# EAGLE design Schematic (EAGLE 9.3.0)

## Sheet 1 of 3: In/Out
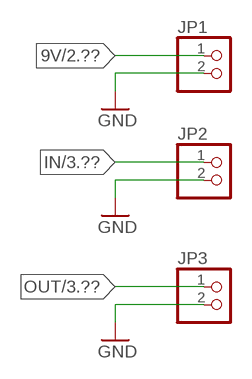
[diagram p0: schematic, sheet 1]

### Parts
JP1  PINHD-1X2  [1X02]
JP2  PINHD-1X2  [1X02]
JP3  PINHD-1X2  [1X02]

### Nets
9V: JP1.1 ; also sheet 2,3
GND: JP1.2 JP2.2 JP3.2 ; also sheet 2,3
IN: JP2.1 ; also sheet 3
OUT: JP3.1 ; also sheet 3

## Sheet 2 of 3: Supply
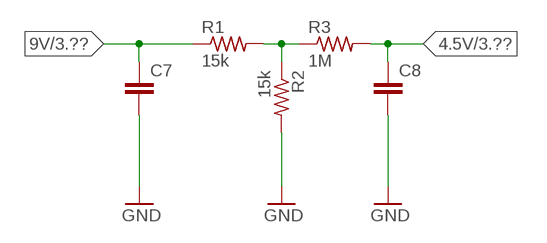
[diagram p1: schematic, sheet 2]

### Parts
C7  C-EU025-025X050  [C025-025X050]
C8  C-EU025-025X050  [C025-025X050]
R1  15k  R-US_0204/7  [0204/7]
R2  15k  R-US_0204/7  [0204/7]
R3  1M  R-US_0204/7  [0204/7]

### Nets
4.5V: C8.1 R3.2 ; also sheet 3
9V: C7.1 R1.1 ; also sheet 1,3
GND: C7.2 C8.2 R2.2 ; also sheet 1,3
N$2: R1.2 R2.1 R3.1

## Sheet 3 of 3: Effect
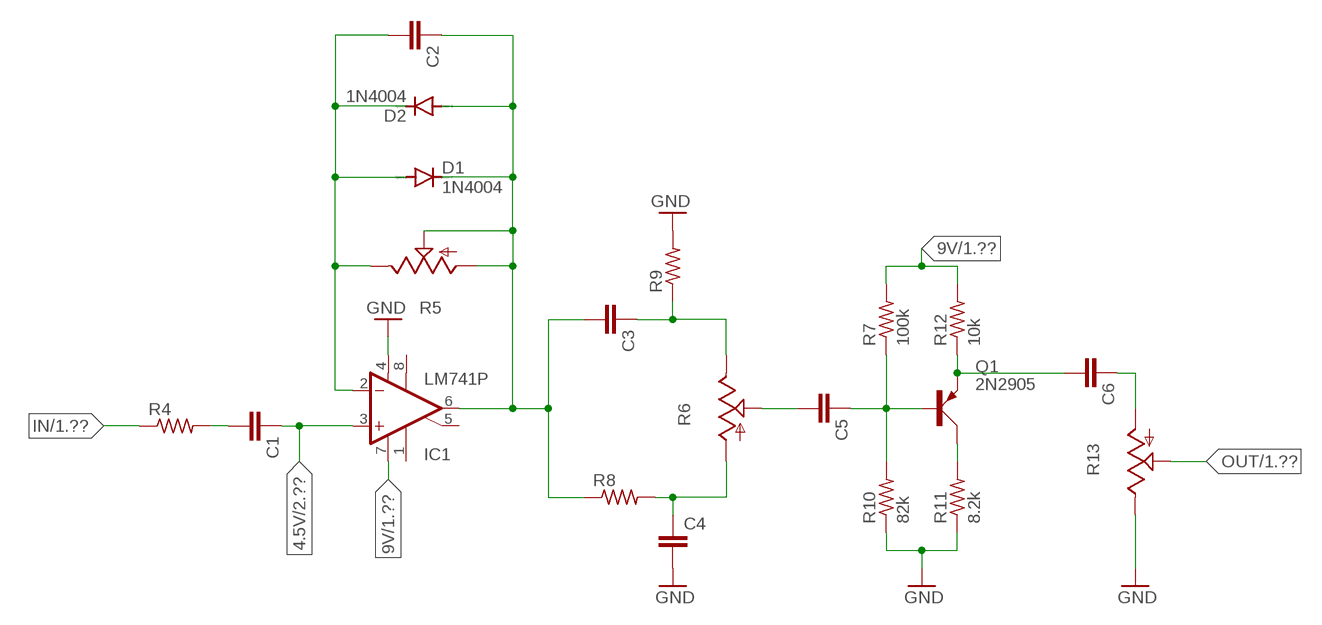
[diagram p2: schematic, sheet 3]

### Parts
C1  C-EU025-025X050  [C025-025X050]
C2  C-EU025-025X050  [C025-025X050]
C3  C-EU025-025X050  [C025-025X050]
C4  C-EU025-025X050  [C025-025X050]
C5  C-EU025-025X050  [C025-025X050]
C6  C-EU025-025X050  [C025-025X050]
D1  1N4004  [DO41-10]
D2  1N4004  [DO41-10]
IC1  LM741P  [DIL08]
Q1  2N2905  [TO39]
R4  R-US_0204/7  [0204/7]
R5  TRIM_US-B64Y  [B64Y]
R6  TRIM_US-B64Y  [B64Y]
R7  100k  R-US_0204/7  [0204/7]
R8  R-US_0204/7  [0204/7]
R9  R-US_0204/7  [0204/7]
R10  82k  R-US_0204/7  [0204/7]
R11  8.2k  R-US_0204/7  [0204/7]
R12  10k  R-US_0204/7  [0204/7]
R13  TRIM_US-B64Y  [B64Y]

### Nets
4.5V: C1.1 IC1.3(+IN) ; also sheet 2
9V: IC1.7(V+) R7.2 R12.2 ; also sheet 1,2
GND: C4.2 IC1.4(V-) R9.2 R10.1 R11.1 R13.E ; also sheet 1,2
IN: R4.1 ; also sheet 1
N$1: C1.2 R4.2
N$3: C2.1 C3.2 D1.C D2.A IC1.6(OUT) R5.A R5.S R8.1
N$4: C2.2 D1.A D2.C IC1.2(-IN) R5.E
N$5: C3.1 R6.E R9.1
N$6: C4.1 R6.A R8.2
N$7: C5.2 R6.S
N$8: C5.1 Q1.2(B) R7.1 R10.2
N$9: C6.2 Q1.1(E) R12.1
N$10: Q1.3(C) R11.2
N$11: C6.1 R13.A
OUT: R13.S ; also sheet 1
Unconnected: IC1.1(ON1) IC1.5(ON2) IC1.8(OPT)

## Library data of the parts
C1-C8 = rcl:C-EU: CAPACITOR, European symbol; SPICEPREFIX: C
D1 D2 = diode:1N4004: DIODE general purpose rectifier, 1 A
IC1 = linear:*741: OP AMP
JP1-JP3 = pinhead:PINHD-1X2: PIN HEADER
Q1 = transistor-small-signal:2N2905: PNP bipolar
R1-R4 R7-R12 = rcl:R-US_: RESISTOR, American symbol; SPICEPREFIX: R
R5 R6 R13 = pot:TRIM_US-: POTENTIOMETER

## Board
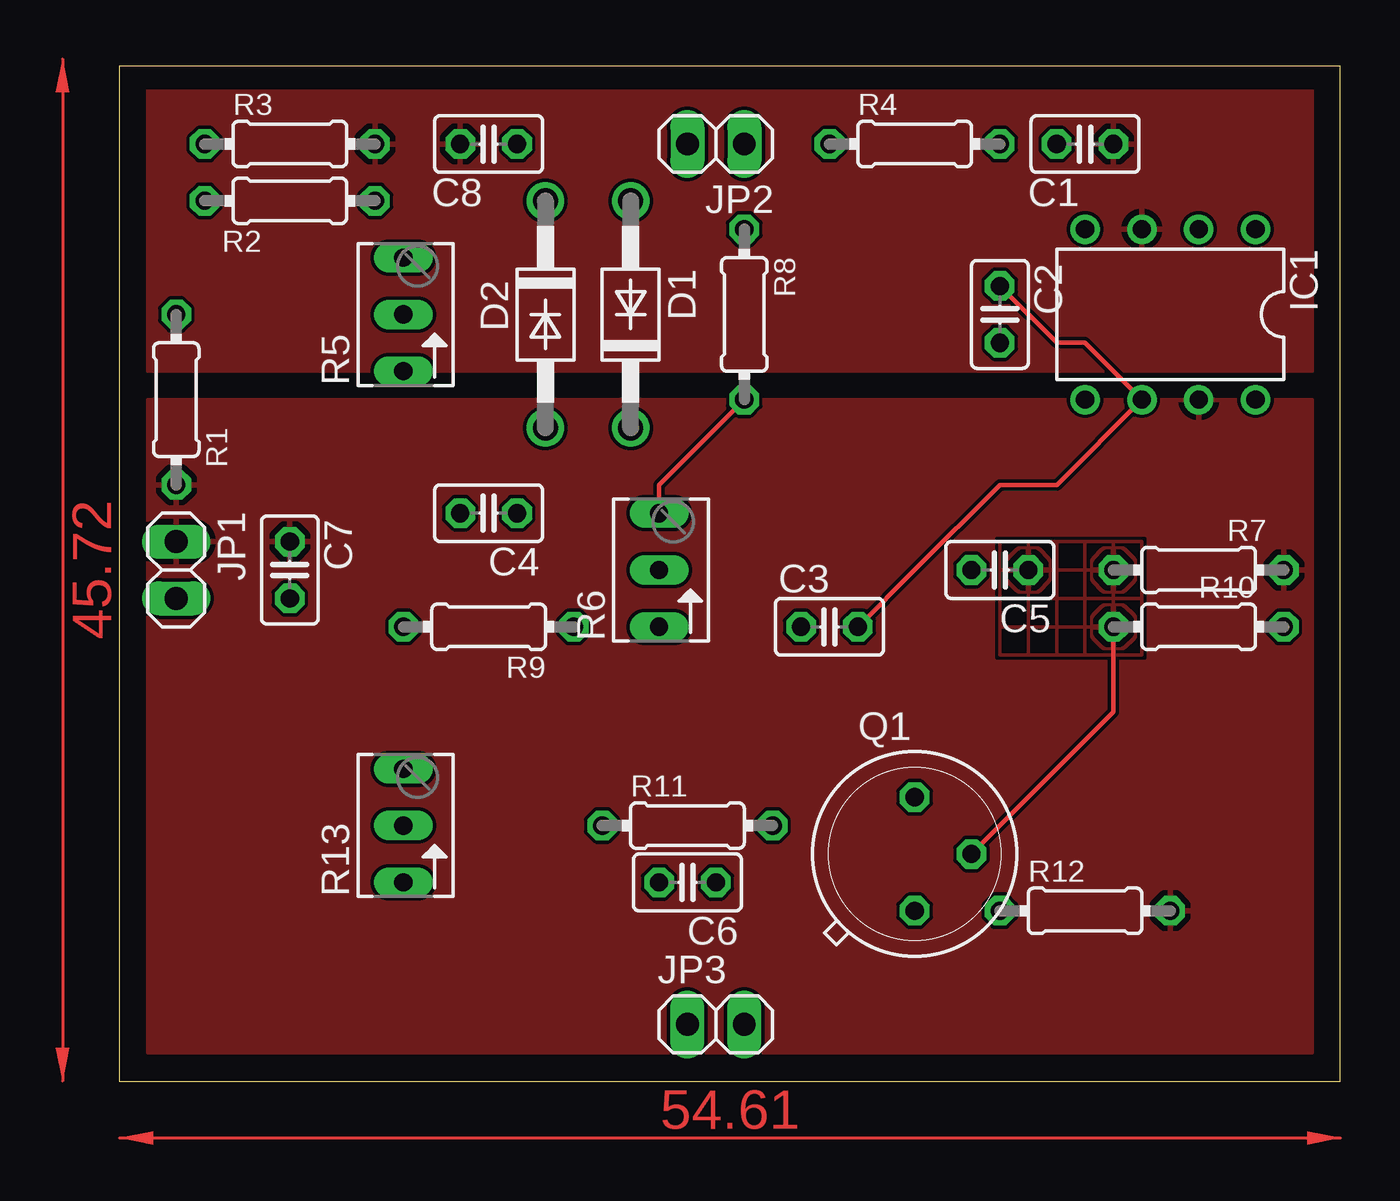
[diagram p3: board, top side]
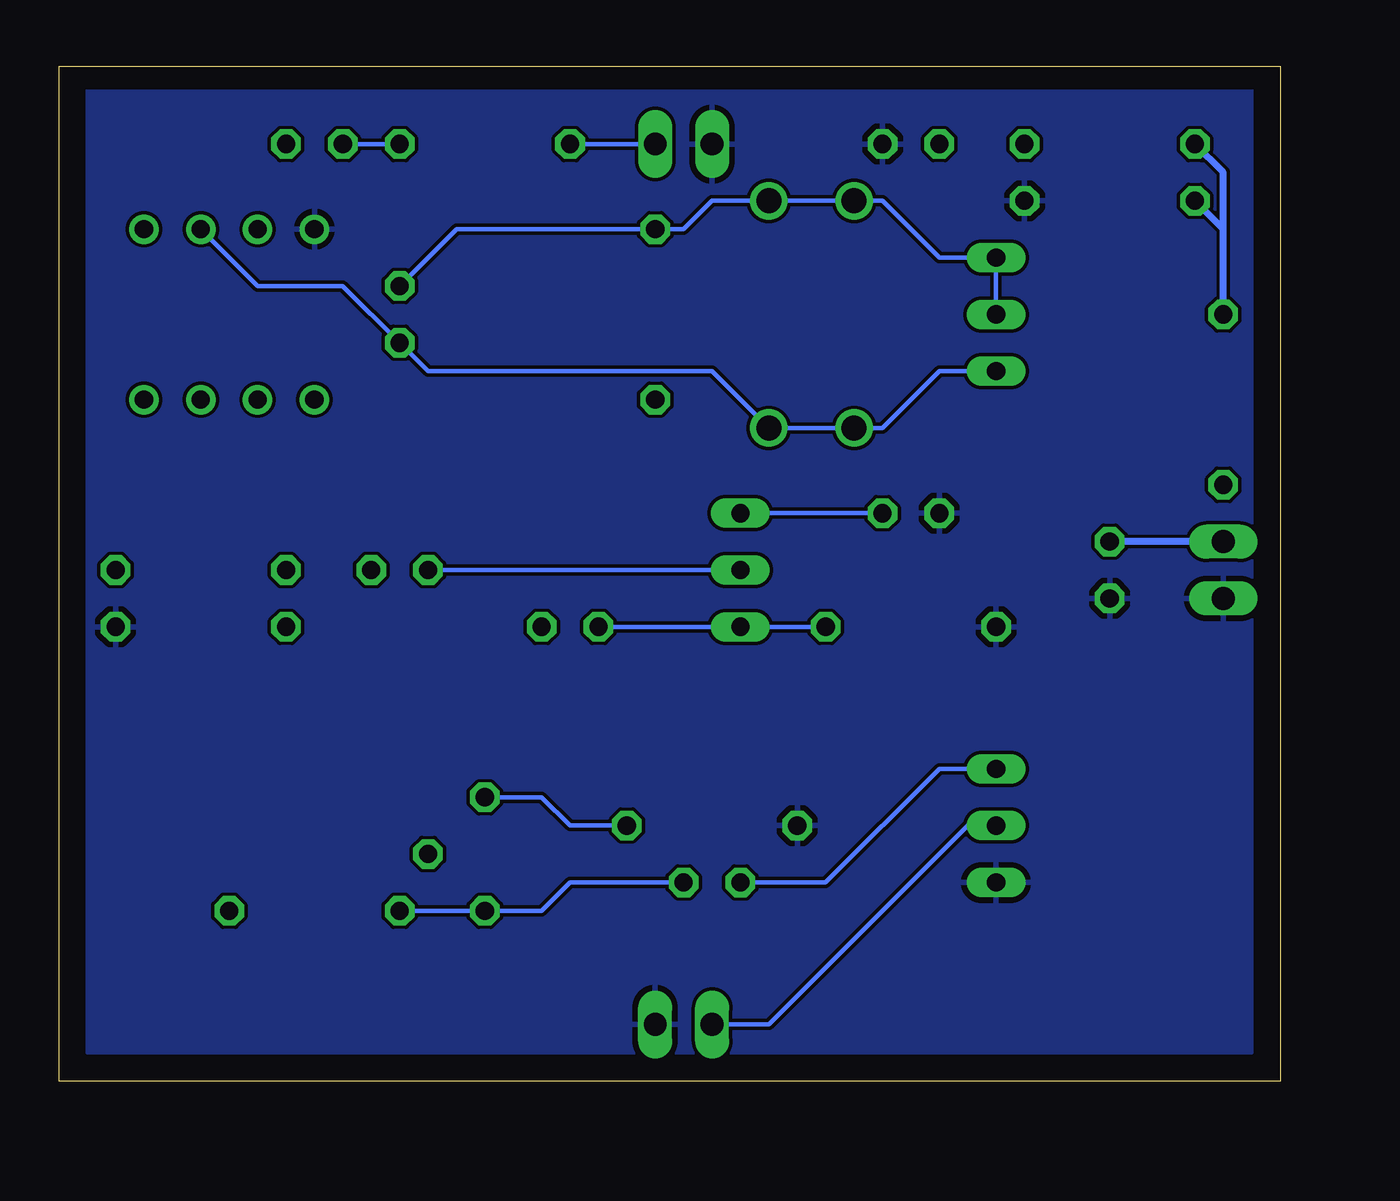
[diagram p4: board, bottom side, seen from below]

Size 54.59 x 45.39 mm. Coordinates in mm from the lower left corner, seen from the top.
Outline: 0,0 54.59,0 54.59,45.39 0,45.39 0,0
Copper layers (1*16): Top 0.035mm / dielectric 1.5mm / Bottom 0.035mm
Design rules "default": minimum track width 6mil, minimum drill 0.35mm, track to track 6mil, track to pad 6mil, pad to pad 6mil, via to via 6mil, smd to smd 6mil, copper to edge 40mil, drill to drill 6mil, minimum pad ring 10mil, minimum via ring 8mil, stop-mask expansion 4mil, vias tented up to drill 0mil, thermal gap 10mil

### Footprints (pad centres in the part's own frame; a part is rotated, then mirrored left to right if it is on the bottom)
C025-025X050 = drill 0.813 octagon: 1 -1.27,0; 2 1.27,0
DO41-10 = drill 1.118: A 5.08,0; C -5.08,0
DIL08 = drill 0.813 pad 1.27: 1 -3.81,-3.81; 2 -1.27,-3.81; 3 1.27,-3.81; 4 3.81,-3.81; 5 3.81,3.81; 6 1.27,3.81; 7 -1.27,3.81; 8 -3.81,3.81
1X02 = drill 1.016 long: 1 -1.27,0; 2 1.27,0
TO39 = drill 0.813 octagon: 1 0,-2.54; 2 2.54,0; 3 0,2.54
0204/7 = drill 0.813 octagon: 1 -3.81,0; 2 3.81,0
B64Y = drill 0.813 long: A 2.54,0; E -2.54,0; S 0,0

### Placement (x,y rotation side)
C1  43.18,41.91 180 top
C2  39.37,34.29 270 top
C3  31.75,20.32 0 top
C4  16.51,25.4 180 top
C5  39.37,22.86 180 top
C6  25.4,8.89 0 top
C7  7.62,22.86 270 top
C8  16.51,41.91 0 top
D1  19.05,34.29 270 top
D2  22.86,34.29 90 top
IC1  46.99,34.29 180 top
JP1  2.54,22.86 270 top
JP2  26.67,41.91 180 top
JP3  26.67,2.54 0 top
Q1  35.56,10.16 0 top
R1  2.54,30.48 90 top
R2  7.62,39.37 0 top
R3  7.62,41.91 0 top
R4  35.56,41.91 0 top
R5  12.7,34.29 90 top
R6  24.13,22.86 90 top
R7  48.26,22.86 0 top
R8  27.94,34.29 270 top
R9  16.51,20.32 180 top
R10  48.26,20.32 180 top
R11  25.4,11.43 0 top
R12  43.18,7.62 0 top
R13  12.7,11.43 90 top

### Tracks (layer width: path | path; a pad name or v marks a point on that pad's centre or on a via)
4.5V
  pour Top: 1.27,44.45 1.27,31.75 53.34,31.75 53.34,44.45
9V
  Bottom 0.305: JP1.1 C7.1
  pour Top (rank 2): 1.27,30.48 1.27,1.27 53.34,1.27 53.34,30.48
GND
  pour Bottom: 1.27,44.45 1.27,1.27 53.34,1.27 53.34,44.45
IN
  Bottom 0.203: JP2.1 R4.1
N$1
  Bottom 0.203: R4.2 C1.2
N$2
  Bottom 0.305: R1.2 2.54,38.1 | 2.54,38.1 R2.1 | 2.54,38.1 2.54,40.64 R3.1
N$3
  Top 0.203: C3.2 35.56,22.86 39.37,26.67 41.91,26.67 IC1.6 43.18,33.02 41.91,33.02 C2.1
  Bottom 0.203: R5.S R5.A 15.24,36.83 17.78,39.37 D1.C D2.A 25.4,39.37 26.67,38.1 R8.1 36.83,38.1 C2.1
N$4
  Bottom 0.203: R5.E 15.24,31.75 17.78,29.21 D1.A D2.C 25.4,31.75 38.1,31.75 C2.2 41.91,35.56 45.72,35.56 IC1.2
N$5
  Bottom 0.203: R9.1 R6.E C3.1
N$6
  Top 0.203: R6.A 24.13,26.67 R8.2
  Bottom 0.203: R6.A C4.1
N$7
  Bottom 0.203: C5.2 R6.S
N$8
  Top 0.203: Q1.2 44.45,16.51 R10.2
  pour Top (hatched): 39.37,24.13 39.37,19.05 45.72,19.05 45.72,24.13
N$9
  Bottom 0.203: C6.2 31.75,8.89 33.02,7.62 Q1.1 R12.1
N$10
  Bottom 0.203: Q1.3 33.02,12.7 31.75,11.43 R11.2
N$11
  Bottom 0.203: C6.1 20.32,8.89 15.24,13.97 R13.A
OUT
  Bottom 0.203: R13.S 13.97,11.43 22.86,2.54 JP3.1
(copper drawn outside any net)
  shapes: Top area x2